# Altium schematic sheet Motor_Control.SchDoc
size A4; SheetNumber: 9; SheetTotal: 12
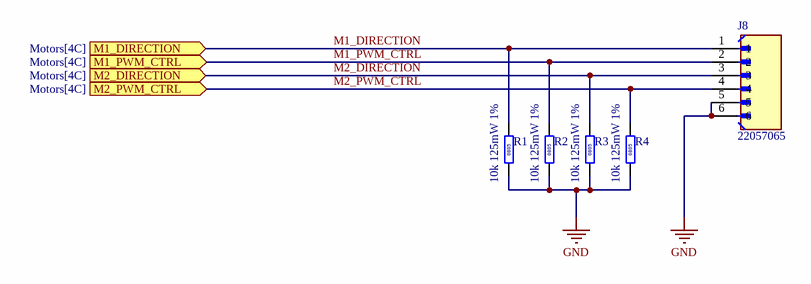
[diagram p0: Motor_Control.SchDoc]

## Parts
J8  22057065  [MOLEX_22057065]
R1  10k 125mW 1%  [RESC2013X60X35ML10T20]
R2  10k 125mW 1%  [RESC2013X60X35ML10T20]
R3  10k 125mW 1%  [RESC2013X60X35ML10T20]
R4  10k 125mW 1%  [RESC2013X60X35ML10T20]

## Ports
M1_DIRECTION (in, see Motors[4C]), M1_PWM_CTRL (in, see Motors[4C]), M2_DIRECTION (in, see Motors[4C]), M2_PWM_CTRL (in, see Motors[4C])

## Nets
GND: J8.5 J8.6 R1.1 R2.1 R3.1 R4.1
M1_DIRECTION: J8.1 R1.2 ; port M1_DIRECTION
M1_PWM_CTRL: J8.2 R2.2 ; port M1_PWM_CTRL
M2_DIRECTION: J8.3 R3.2 ; port M2_DIRECTION
M2_PWM_CTRL: J8.4 R4.2 ; port M2_PWM_CTRL

## Library data of the parts
J8 = 22057065: Conn Shrouded Header (4 Sides) HDR 6 POS 2.5mm Solder RA Side Entry Thru-Hole SPOXâ„¢ Bag; MF: Molex; SnapEDA_Link: https://www.snapeda.com/parts/22057065/Molex/view-part/?ref=snap; Package: None; Value: *; MP: 22057065; Check_prices: https://www.snapeda.com/parts/22057065/Molex/view-part/?ref=eda
R1-R4 = CMP-40-025-00226-1: Res, SMD, 10k, 125mW, 1%, ±200ppm, 0805; Manufacturer: Panasonic; ManufacturerPartNumber: ERJ-6GEYJ103V; Package Height: 0.6mm; ComponentLinkDescription: Datasheet; Voltage Rating: 150V; Tolerance: 5%; RoHS3Certificate: https://download.siliconexpert.com/pdfs2/2024/6/2/9/59/48/925943/pns_/manual/erj6enf2700v_rohs.pdf; Composition: Thick Film; Contact Plating: Tin; Reach SVHC Compliant: Unaffected; ComponentLinkURL: https://octopart.com/erj-6geyj103v-panasonic-55422885; Temperature Coefficient (ppm/cel): ±200ppm; Resistance: 10k; Max Operating Temperature: 155°C; Mount: SMD; Number of Pins: 2; Case/Package: 0805; RoHS3Compliant: Yes (with exeption); Power Rating: 125mW; Resistor Type: Fixed; Min Operating Temperature: -55°C